# EAGLE design esp-prog (EAGLE 7.6.0)
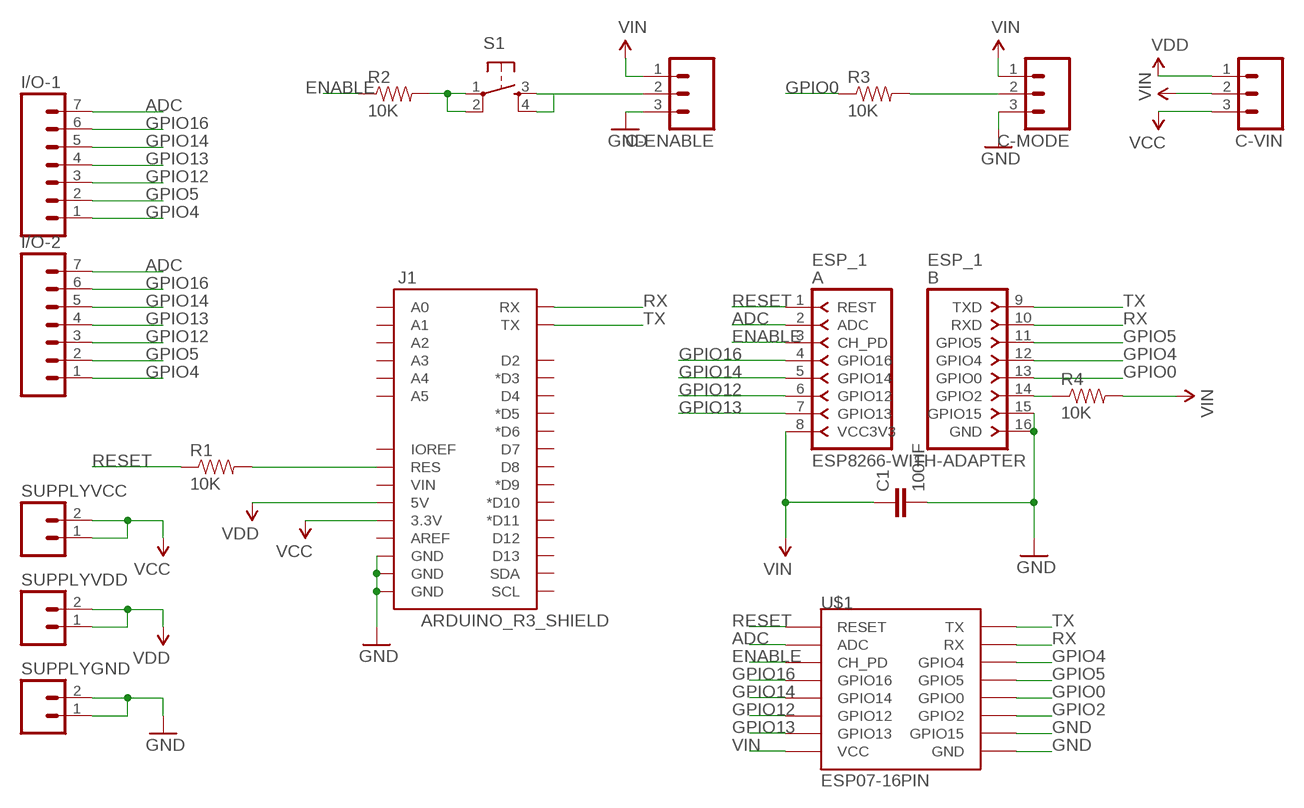
[diagram p0: schematic, sheet 1]

## Parts
C1  100nF  CAP0805  [0805]
C-ENABLE  M031X03_NO_SILK  [1X03_NO_SILK]
C-MODE  M031X03_NO_SILK  [1X03_NO_SILK]
C-VIN  M031X03_NO_SILK  [1X03_NO_SILK]
ESP_1  ESP8266-WITH-ADAPTER  [ESP8266-ADAPTER]
I/O-1  M07  [1X07]
I/O-2  M07  [1X07]
J1  ARDUINO_R3_SHIELD  [UNO_R3_SHIELD]
R1  10K  RESISTOR0805-RES  [0805]
R2  10K  RESISTOR0805-RES  [0805]
R3  10K  RESISTOR0805-RES  [0805]
R4  10K  RESISTOR0805-RES  [0805]
S1  TAC_SWITCHPTH  [TACTILE-PTH]
SUPPLYGND  M02PTH  [1X02]
SUPPLYVCC  M02PTH  [1X02]
SUPPLYVDD  M02PTH  [1X02]
U$1  ESP07-16PIN  [ESP07-16PIN]

## Nets
ADC: ESP_1.2(ADC) I/O-1.7 I/O-2.7 U$1.ADC
ENABLE: ESP_1.3(CH_PD) R2.1 U$1.CH_PD
GND: C1.2 C-ENABLE.3 C-MODE.3 ESP_1.15(GPIO15) ESP_1.16(GND) J1.GND@0(GND) J1.GND@1(GND) J1.GND@2(GND) SUPPLYGND.1 SUPPLYGND.2 U$1.GND U$1.GPIO15
GPIO0: ESP_1.13(GPIO0) R3.1 U$1.GPIO0
GPIO2: ESP_1.14(GPIO2) R4.1 U$1.GPIO2
GPIO4: ESP_1.12(GPIO4) I/O-1.1 I/O-2.1 U$1.GPIO4
GPIO5: ESP_1.11(GPIO5) I/O-1.2 I/O-2.2 U$1.GPIO5
GPIO12: ESP_1.6(GPIO12) I/O-1.3 I/O-2.3 U$1.GPIO12
GPIO13: ESP_1.7(GPIO13) I/O-1.4 I/O-2.4 U$1.GPIO13
GPIO14: ESP_1.5(GPIO14) I/O-1.5 I/O-2.5 U$1.GPIO14
GPIO16: ESP_1.4(GPIO16) I/O-1.6 I/O-2.6 U$1.GPIO16
N$1: J1.RES R1.2
N$2: C-MODE.2 R3.2
N$3: R2.2 S1.1 S1.2
N$5: C-ENABLE.2 S1.3 S1.4
RESET: ESP_1.1(REST) R1.1 U$1.REST(RESET)
RX: ESP_1.10(RXD) J1.RX U$1.RX
TX: ESP_1.9(TXD) J1.TX U$1.TX
VBAT [SUPPLY]: C-VIN.1 J1.5V SUPPLYVDD.1 SUPPLYVDD.2 ; supply symbol labelled VDD
VCC [SUPPLY]: C-VIN.3 J1.3.3V SUPPLYVCC.1 SUPPLYVCC.2
VIN [SUPPLY]: C1.1 C-ENABLE.1 C-MODE.1 C-VIN.2 ESP_1.8(VCC3V3) R4.2 U$1.VCC
Unconnected: J1.A0 J1.A1 J1.A2 J1.A3 J1.A4 J1.A5 J1.AREF J1.D2 J1.D3(*D3) J1.D4 J1.D5(*D5) J1.D6(*D6) J1.D7 J1.D8 J1.D9(*D9) J1.D10(*D10) J1.D11(*D11) J1.D12 J1.D13 J1.IOREF J1.SCL J1.SDA J1.VIN

## Library data of the parts
C1 = SparkFun-Capacitors:CAP: Capacitor Standard 0603 ceramic capacitor, and 0.1" leaded capacitor.
C-ENABLE C-MODE C-VIN = SparkFun-Connectors:M03: Header 3 Standard 3-pin 0.1" header. Use with straight break away headers (SKU : PRT-00116), right angle break away headers (PRT-00553), swiss pins (PRT-00743), machine pins (PRT-00117), and female headers (PRT-00115). Molex polarized connector foot print use with SKU : PRT-08232 with associated crimp pins and housings.
ESP_1 = esp8266_with_adapter:ESP8266-WITH-ADAPTER: ESP8266 Adapter for ESP8266-03, ESP8266-04, ESP8266-07, ESP8266-08, ESP8266-12 and similar. (c) by Bartosz Batorek obi--wan@wp.pl
I/O-1 I/O-2 = SparkFun-Connectors:M07: Header 7 Standard 7-pin 0.1" header. Use with straight break away headers (SKU : PRT-00116), right angle break away headers (PRT-00553), swiss pins (PRT-00743), machine pins (PRT-00117), and female headers (PRT-00115). NOTES ON THE VARIANTS LOCK and LOCK_LONGPADS... This footprint was designed to help hold the alignment of a through-hole component (i.e. 7-pin header) while soldering it into place. You may notice that each hole has been shifted either up or down by 0.005 of an inch from it's more standard position (which is usually a perfectly straight line). This slight alteration caused the pins (the squares in the middle) to touch the edges of the holes. Because they are alternating, it causes a "brace" to hold the header in place. 0.005 has proven to be the perfect amount of "off-center" position when using our standard breakaway headers. Although looks a little odd when you look at the bare footprint, once you have a header in there, the alteration is very hard to notice. Also, if you push a header all the way into place, it is covered up entirely on the bottom side. This idea of altering the position of holes to aid alignment will be further integrated into the Sparkfun Library for other footprints. It can help hold any component with 3 or more connection pins.
J1 = SparkFun-Boards:ARDUINO_R3_SHIELD: Shield form compatible with the Arduino Uno R3.
R1-R4 = SparkFun-Resistors:RESISTOR: Resistor Basic schematic elements and footprints for 0603, 1206, and PTH resistors.
S1 = SparkFun-Retired:TAC_SWITCH: Momentary Switch Button commonly used for reset or general input. Spark Fun Electronics SKU : COM-00097 SMT- SWCH-08247
SUPPLYGND SUPPLYVCC SUPPLYVDD = SparkFun-Connectors:M02: Standard 2-pin 0.1" header. Use with - straight break away headers ( PRT-00116) - right angle break away headers (PRT-00553) - swiss pins (PRT-00743) - machine pins (PRT-00117) - female headers (PRT-00115) Molex polarized connector foot print use with: PRT-08233 with associated crimp pins and housings. 2.54_SCREWTERM for use with PRT-10571. 3.5mm Screw Terminal footprints for PRT-08084 5mm Screw Terminal footprints for use with PRT-08432
U$1 = esp8266modules:ESP07-16PIN: ESP8266 Wifi module 07 - 16 pins; DIMENSIONS: 22.0 x 16.0 mm; PINS: 16; PITCH: 0.078" / 2 mm

## Net classes
1 SUPPLY: width 0.5 mm, drill 0.2 mm, clearance 0.5 mm

## Board
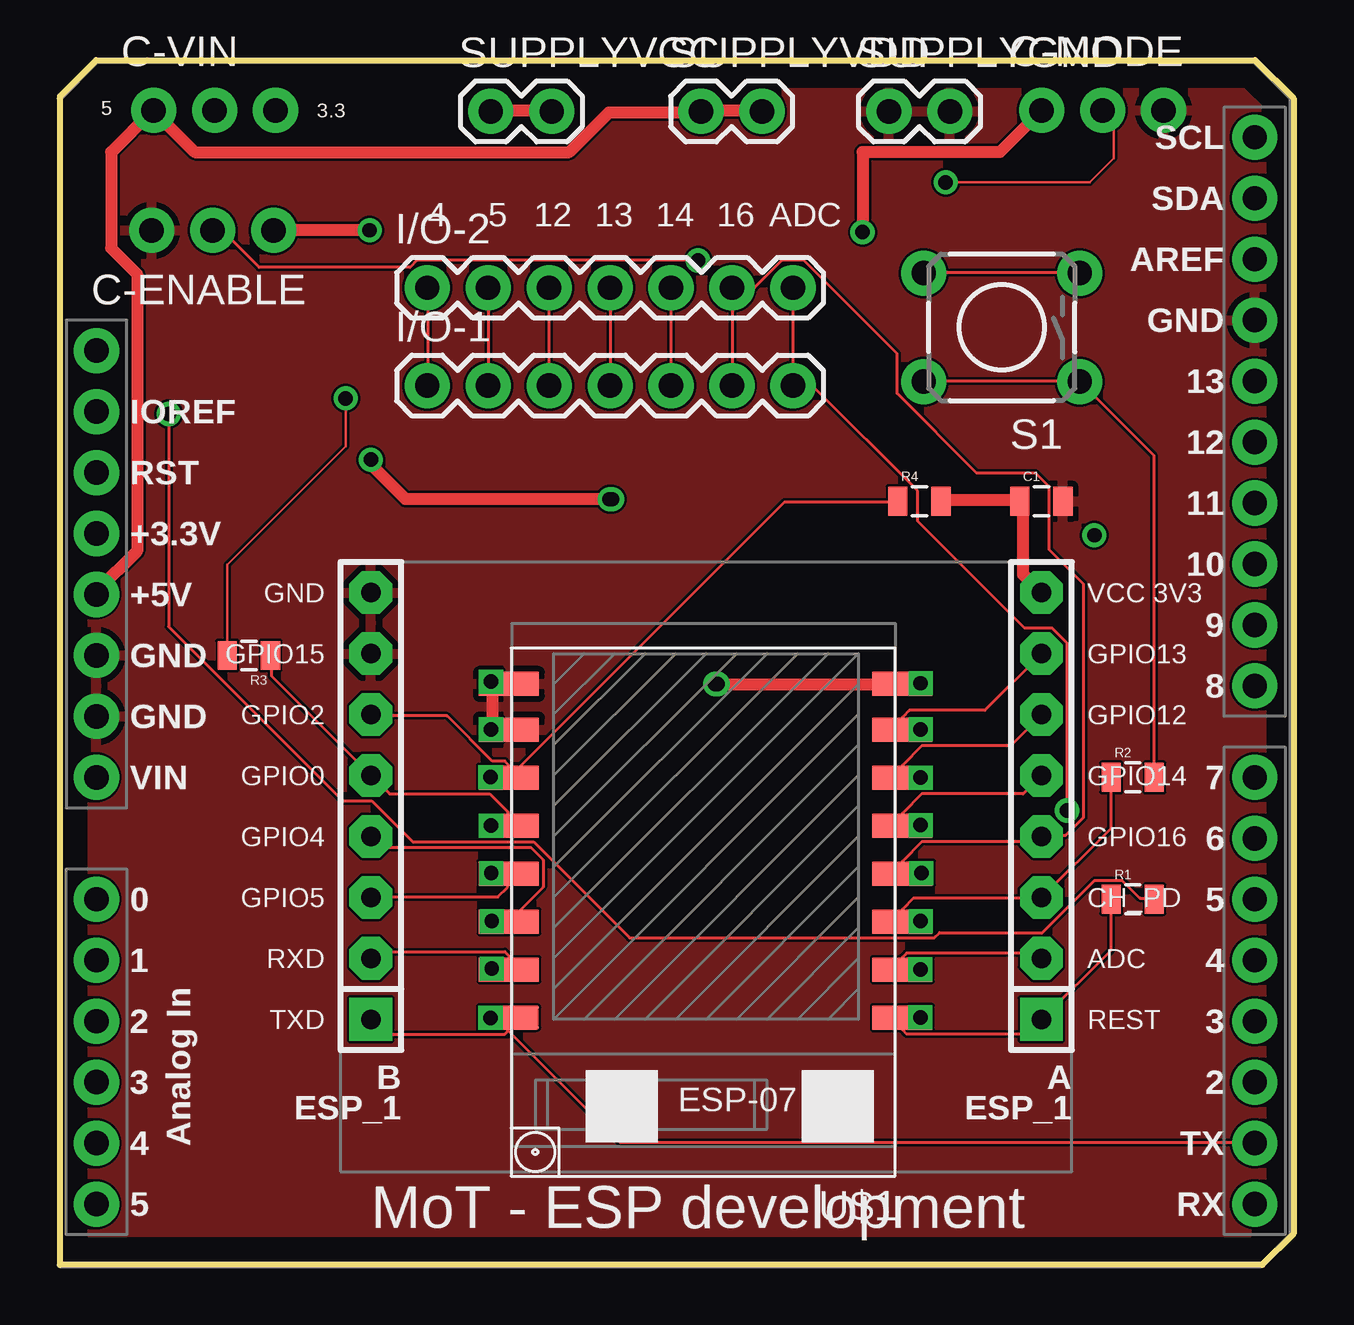
[diagram p1: board, top side]
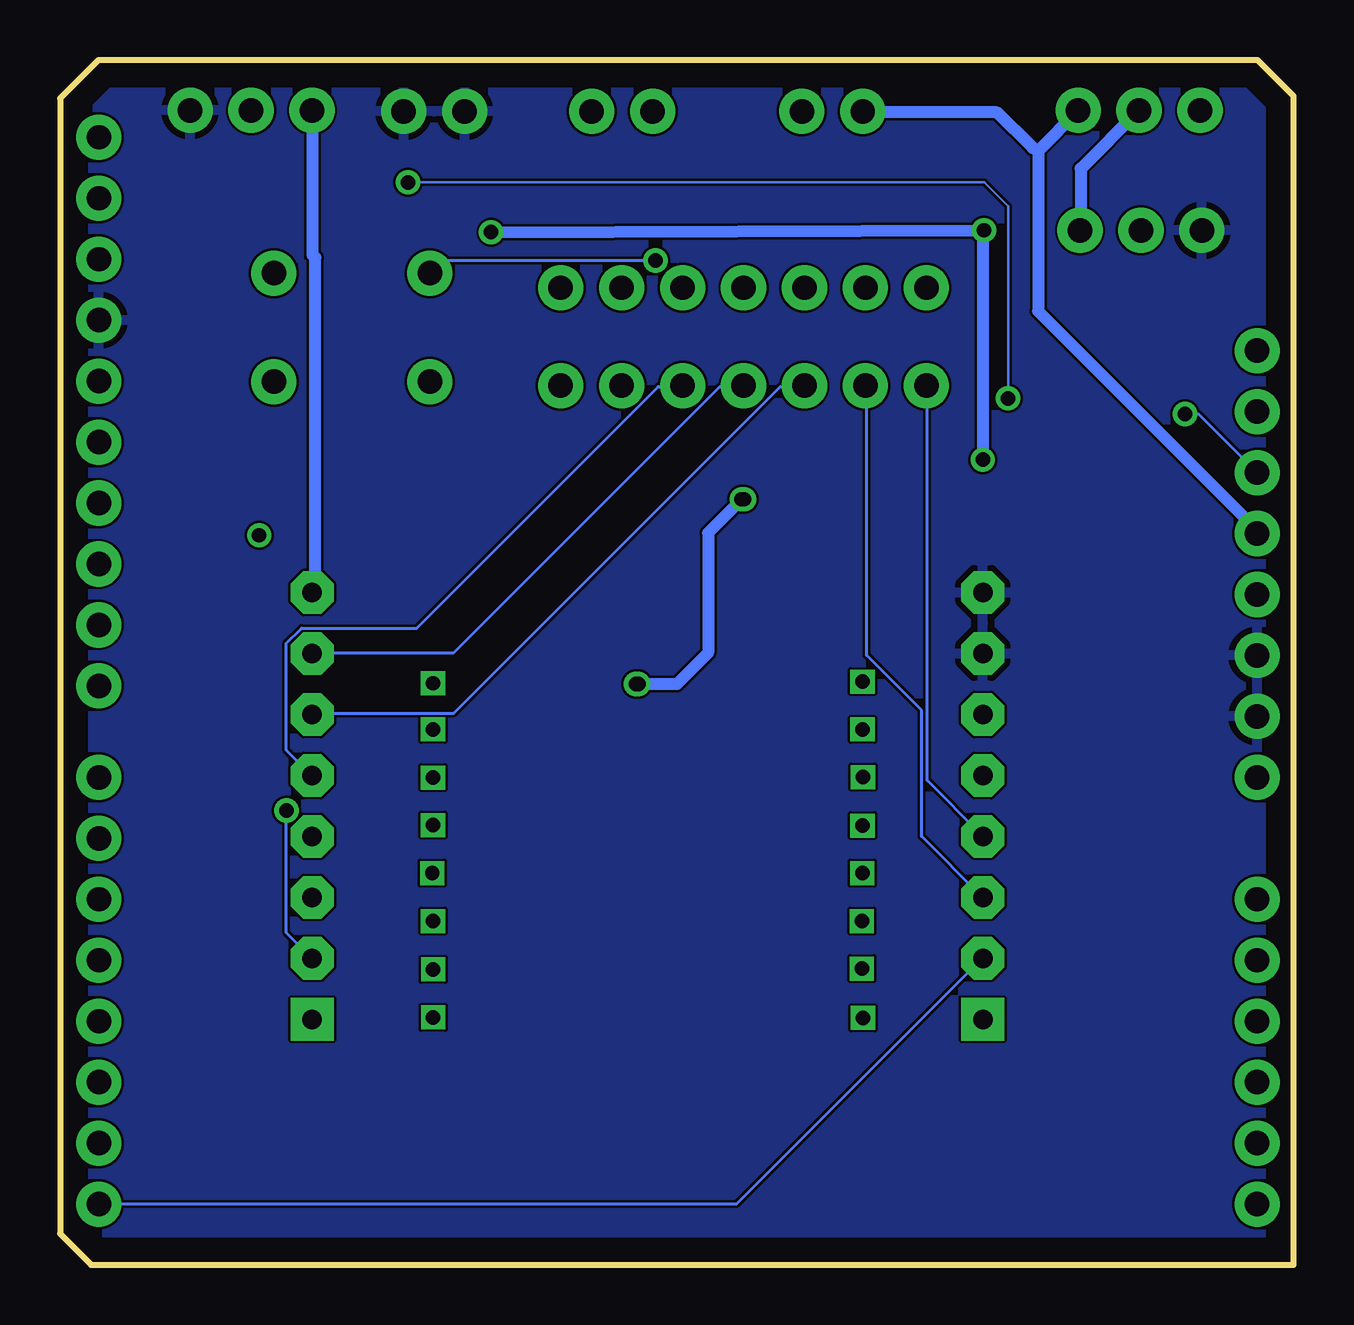
[diagram p2: board, bottom side, seen from below]

Size 51.4 x 50.2 mm. Coordinates in mm from the lower left corner, seen from the top.
Outline: 0,48.7 1.5,50.2 49.8,50.2 51.4,48.6 51.4,1.3 50.1,0 0,0 0,48.7
Copper layers (1*16): Top 0.035mm / dielectric 1.5mm / Bottom 0.035mm
Design rules "baballe": minimum track width 5mil, minimum drill 24mil, track to track 4mil, track to pad 4mil, pad to pad 4mil, via to via 4mil, smd to smd 2mil, copper to edge 40mil, drill to drill 8mil, minimum pad ring 10mil, minimum via ring 8mil, stop-mask expansion 4mil, vias tented up to drill 0mil, thermal gap 10mil

### Footprints (pad centres in the part's own frame; a part is rotated, then mirrored left to right if it is on the bottom)
0805 = smd 0.8 x 1.2: 1 -0.9,0; 2 0.9,0
1X03_NO_SILK = drill 1.016 pad 1.88: 1 0,0; 2 2.54,0; 3 5.08,0
ESP8266-ADAPTER = drill 0.813 pad 1.778 square: 1 -13.97,8.89; 9 13.97,8.89 | drill 0.813 pad 1.778 octagon: 2 -13.97,6.35; 3 -13.97,3.81; 4 -13.97,1.27; 5 -13.97,-1.27; 6 -13.97,-3.81; 7 -13.97,-6.35; 8 -13.97,-8.89; 10 13.97,6.35; 11 13.97,3.81; 12 13.97,1.27; 13 13.97,-1.27; 14 13.97,-3.81; 15 13.97,-6.35; 16 13.97,-8.89
1X07 = drill 1.016 pad 1.88: 1 0,0; 2 2.54,0; 3 5.08,0; 4 7.62,0; 5 10.16,0; 6 12.7,0; 7 15.24,0
UNO_R3_SHIELD = drill 1.016 pad 1.88: 3.3V 50.8,26.67; 5V 50.8,29.21; A0 50.8,41.91; A1 50.8,44.45; A2 50.8,46.99; A3 50.8,49.53; A4 50.8,52.07; A5 50.8,54.61; AREF 2.54,15.24; D2 2.54,49.53; D3 2.54,46.99; D4 2.54,44.45; D5 2.54,41.91; D6 2.54,39.37; D7 2.54,36.83; D8 2.54,33.02; D9 2.54,30.48; D10 2.54,27.94; D11 2.54,25.4; D12 2.54,22.86; D13 2.54,20.32; GND@0 50.8,31.75; GND@1 50.8,34.29; GND@2 2.54,17.78; IOREF 50.8,21.59; NC 50.8,19.05; RES 50.8,24.13; RX 2.54,54.61; SCL 2.54,10.16; SDA 2.54,12.7; TX 2.54,52.07; VIN 50.8,36.83
TACTILE-PTH = drill 1.016 pad 1.88: 1 -3.251,2.261; 2 3.251,2.261; 3 -3.251,-2.261; 4 3.251,-2.261
1X02 = drill 1.016 pad 1.88: 1 0,0; 2 2.54,0
ESP07-16PIN = smd 2.5 x 1: ADC -8.2,3.8; CH_PD -8.2,1.8; GND 8.2,-8.105; GPIO0 8.2,-2.2; GPIO2 8.2,-4.2; GPIO4 8.2,1.8; GPIO5 8.2,-0.2; GPIO12 -8.2,-4.2; GPIO13 -8.2,-6.2; GPIO14 -8.2,-2.2; GPIO15 8.2,-6.2; GPIO16 -8.2,-0.2; REST -8.2,5.8; RX 8.2,3.8; TX 8.2,5.8; VCC -8.2,-8.105

### Placement (x,y rotation side)
C1  40.89,31.82 0 top
C-ENABLE  8.9,43.1 180 top
C-MODE  40.9,48.1 0 top
C-VIN  3.9,48.1 0 top
ESP_1  26.92,19.12 180 top
I/O-1  15.3,36.63 0 top
I/O-2  15.3,40.71 0 top
J1  52.32,57.14 180 top
R1  44.7,15.23 0 top
R2  44.7,20.31 0 top
R3  7.87,25.39 180 top
R4  35.81,31.82 0 top
S1  39.24,39.06 180 top
SUPPLYGND  34.54,48.06 0 top
SUPPLYVCC  17.95,48.06 0 top
SUPPLYVDD  26.71,48.06 0 top
U$1  26.9,16.1 180 top

### Tracks (layer width: path | path; a pad name or v marks a point on that pad's centre or on a via)
ADC  (via drill 0.61)
  Top 0.127: 30.53,36.65 I/O-1.7 | I/O-2.7 30.53,40.65 30.53,36.71 I/O-1.7 | U$1.ADC 35.1,12.82 35.28,12.99 40.71,12.99 40.88,12.82 ESP_1.2 | v41.96,18.93 41.96,25.9 41.33,26.53 40.19,26.53 35.73,30.99 35.73,32.25 31.39,36.59 30.59,36.59 I/O-1.7
  Bottom 0.127: v41.96,18.93 41.96,13.85 40.93,12.82 ESP_1.2
ENABLE
  Top 0.127: R2.1 43.79,18.19 40.93,15.33 ESP_1.3 40.88,15.27 35.56,15.27 35.1,14.82 U$1.CH_PD
GND
  Top 0.127: 12.95,26.08 12.93,26.08 ESP_1.15
  Top 0.5: U$1.GND 18,24.2 18,22.2 18.7,22.2 U$1.GPIO15
  pour Bottom: 1.52,50.14 49.78,50.14 51.32,48.6 51.32,1.26 50.05,-0.01 -0.02,-0.01 -0.02,48.6
  pour Top: 1.52,50.14 49.78,50.14 51.32,48.6 51.32,1.26 50.05,-0.01 -0.02,-0.01 -0.02,48.6
GPIO0
  Top 0.127: R3.1 8.82,25.39 8.82,24.53 12.93,20.42 ESP_1.13 12.99,20.36 13.73,19.62 17.9,19.62 18.65,18.88 18.65,18.3 U$1.GPIO0
GPIO2
  Top 0.127: 34.93,31.79 R4.1 34.88,31.79 30.19,31.79 U$1.GPIO2 18.93,20.59 18.53,20.99 18.02,20.99 16.13,22.88 12.99,22.88 ESP_1.14
GPIO4
  Top 0.127: I/O-1.1 15.33,36.65 15.33,40.71 I/O-2.1 | U$1.GPIO4 20.13,15.73 20.13,16.88 19.62,17.39 13.45,17.39 12.99,17.85 ESP_1.12
  Bottom 0.127: I/O-1.1 15.27,36.59 15.27,20.19 12.99,17.9 ESP_1.12
GPIO5
  Top 0.127: I/O-1.2 17.85,36.65 I/O-2.2 | U$1.GPIO5 18.65,16.25 18.65,15.73 18.25,15.33 12.99,15.33 ESP_1.11
  Bottom 0.127: I/O-1.2 17.79,36.59 17.79,25.39 15.5,23.1 15.5,17.85 12.99,15.33 ESP_1.11
GPIO12
  Top 0.127: 20.36,36.65 I/O-1.3 20.36,36.71 20.36,40.65 I/O-2.3 20.36,40.71 | U$1.GPIO12 35.1,20.82 35.91,21.62 39.62,21.62 40.88,22.88 ESP_1.6
  Bottom 0.127: I/O-1.3 20.42,36.59 21.39,36.59 34.99,22.99 40.82,22.99 40.88,22.93 ESP_1.6
GPIO13
  Top 0.127: 22.93,36.65 I/O-1.4 22.93,36.71 22.93,40.65 I/O-2.4 22.93,40.71 | U$1.GPIO13 35.1,22.82 35.39,23.1 38.53,23.1 40.88,25.45 ESP_1.7
  Bottom 0.127: I/O-1.4 22.93,36.59 23.9,36.59 34.99,25.5 40.88,25.5 ESP_1.7
GPIO14
  Top 0.127: 25.45,36.65 I/O-1.5 25.45,36.71 25.45,40.65 I/O-2.5 25.45,40.71 | U$1.GPIO14 35.1,18.82 35.91,19.62 40.13,19.62 40.88,20.36 ESP_1.5
  Bottom 0.127: I/O-1.5 25.5,36.59 26.48,36.59 36.53,26.53 41.33,26.53 41.96,25.9 41.96,21.45 40.93,20.42 ESP_1.5
GPIO16
  Top 0.127: 28.02,36.65 I/O-1.6 28.02,36.71 28.02,40.65 I/O-2.6 | 28.02,40.71 I/O-2.6 | U$1.GPIO16 35.1,16.82 35.91,17.62 40.65,17.62 40.88,17.85 ESP_1.4 40.93,17.9 41.91,17.9 42.65,18.65 42.65,28.36 41.22,29.79 41.22,32.42 40.65,32.99 38.19,32.99 34.88,36.31 34.88,37.96 30.99,41.85 30.08,41.85 28.93,40.71 28.08,40.71 I/O-2.6
N$1  (via drill 0.61)
  Top 0.127: v4.53,35.45 4.53,26.59 11.79,19.33 12.99,19.33 14.7,17.62 19.73,17.62 23.73,13.62 36.42,13.62 36.65,13.85 40.93,13.85 43.11,16.02 44.25,16.02 44.99,15.27 45.56,15.27 R1.2
  Bottom 0.127: v4.53,35.45 3.96,35.45 J1.RES
N$2  (via drill 0.6)
  Top 0.1: R3.2 6.97,29.17 11.9,34.1 v11.9,36.1 | v36.9,45.1 42.9,45.1 43.9,46.1 43.9,47.64 C-MODE.2
  Bottom 0.1: v11.9,36.1 11.9,44.1 12.9,45.1 v36.9,45.1
N$3
  Top 0.127: R2.2 45.56,20.36 45.56,33.73 42.53,36.76 S1.1 42.48,36.82 36.02,36.82 S1.2
N$4  (via drill 0.6)
  other vias: 17.96,24.3
N$5  (via drill 0.61)
  Top 0.127: S1.4 36.02,41.34 42.48,41.34 S1.3 | v26.59,41.85 14.87,41.85 14.59,41.56 8.3,41.56 6.82,43.05 6.42,43.05 C-ENABLE.2
  Bottom 0.127: v26.59,41.85 35.45,41.85 35.96,41.34 S1.4
N$6  (via drill 0.6)
  other vias: 17.96,22.31
N$7  (via drill 0.6)
  other vias: 17.94,20.32
N$8  (via drill 0.6)
  other vias: 17.96,18.3
N$9  (via drill 0.6)
  other vias: 17.97,16.32
N$10  (via drill 0.6)
  other vias: 17.99,14.32
N$11  (via drill 0.6)
  other vias: 17.99,12.34
N$12  (via drill 0.6)
  other vias: 17.94,10.29
N$13  (via drill 0.6)
  other vias: 35.85,10.31
N$14  (via drill 0.6)
  other vias: 35.85,12.31
N$15  (via drill 0.6)
  other vias: 35.86,14.32
N$16  (via drill 0.6)
  other vias: 35.89,16.32
N$17  (via drill 0.6)
  other vias: 35.86,18.32
N$18  (via drill 0.6)
  other vias: 35.86,20.3
N$19  (via drill 0.6)
  other vias: 35.86,22.31
N$20  (via drill 0.6)
  other vias: 35.86,24.23
N$21  (via drill 0.6)
  other vias: 43.1,30.4
N$22  (via drill 0.6)
  other vias: 22.9,31.9
N$23  (via drill 0.6)
  other vias: 27.4,24.2
RESET
  Top 0.127: R1.1 43.79,15.22 43.79,13.1 40.93,10.24 ESP_1.1 40.88,10.19 40.31,9.62 35.28,9.62 35.1,9.79 35.1,10.24 U$1.REST
RX
  Top 0.127: U$1.RX 18.7,12.87 18.53,13.05 13.22,13.05 12.99,12.82 ESP_1.10
  Bottom 0.127: J1.RX 23.22,2.53 12.99,12.76 ESP_1.10
TX
  Top 0.127: 18.65,9.73 18.65,10.24 U$1.TX | 18.65,9.73 18.53,9.62 13.56,9.62 12.99,10.19 ESP_1.9 | J1.TX 49.74,5.1 23.33,5.1 18.7,9.73 18.65,9.73
VBAT
  Top 0.5: SUPPLYVDD.2 29.22,48.08 26.76,48.08 SUPPLYVDD.1 26.48,48.02 22.88,48.02 21.22,46.36 5.62,46.36 4.07,47.91 C-VIN.1 3.84,48.08 2.13,46.36 2.13,42.36 3.21,41.28 3.21,29.73 1.56,28.08 1.56,27.96 J1.5V
VCC
  Top 0.5: SUPPLYVCC.1 17.96,48.08 20.48,48.08 SUPPLYVCC.2
  Bottom 0.5: 10.65,46.42 10.65,39.73 1.56,30.65 1.56,30.48 J1.3.3V | 10.65,46.42 8.99,48.08 C-VIN.3 | SUPPLYVCC.1 17.9,48.02 12.36,48.02 10.87,46.54 10.65,46.42
VIN  (via drill 0.6)
  Top 0.5: R4.2 36.76,31.85 39.96,31.85 C1.1 40.13,31.62 40.13,28.76 40.88,28.02 ESP_1.8 | v33.44,43.03 33.45,46.36 39.16,46.36 40.88,48.08 C-MODE.1 | v12.9,43.11 C-ENABLE.1 | 35.9,24.2 35.8,24.1 35.1,24.1 U$1.VCC v27.3,24.2 | v12.95,33.55 12.95,33.35 14.4,31.9 v23,31.9
  Bottom 0.5: C-ENABLE.1 8.87,43.11 8.87,45.68 6.47,48.08 C-VIN.2 | C-MODE.1 40.88,48.08 40.88,42.08 40.76,41.96 40.76,28.13 40.88,28.02 ESP_1.8 | v33.44,43.03 v12.9,43.11 | v12.9,43.11 v12.9,43.1 | v12.95,33.55 12.95,43.17 12.9,43.17 v12.9,43.11 | 27.4,24.3 v27.3,24.2 25.7,24.2 24.4,25.5 24.4,30.5 v23,31.9 22.9,31.9 22.8,31.8

### Text on the board
tPlace: 4 | 5 | 12 | 13 | 14 | 16 | ADC | MoT - ESP development
tNames: 5 | 3.3